# Altium schematic sheet SCH_WINGLET_DEBUG.SchDoc: Winglet Debug
size B; DrawnBy: HCAdam; Organization: Aerospace Village; DocumentNumber: WINGLET; Revision: A; SheetNumber: 10; SheetTotal: 10
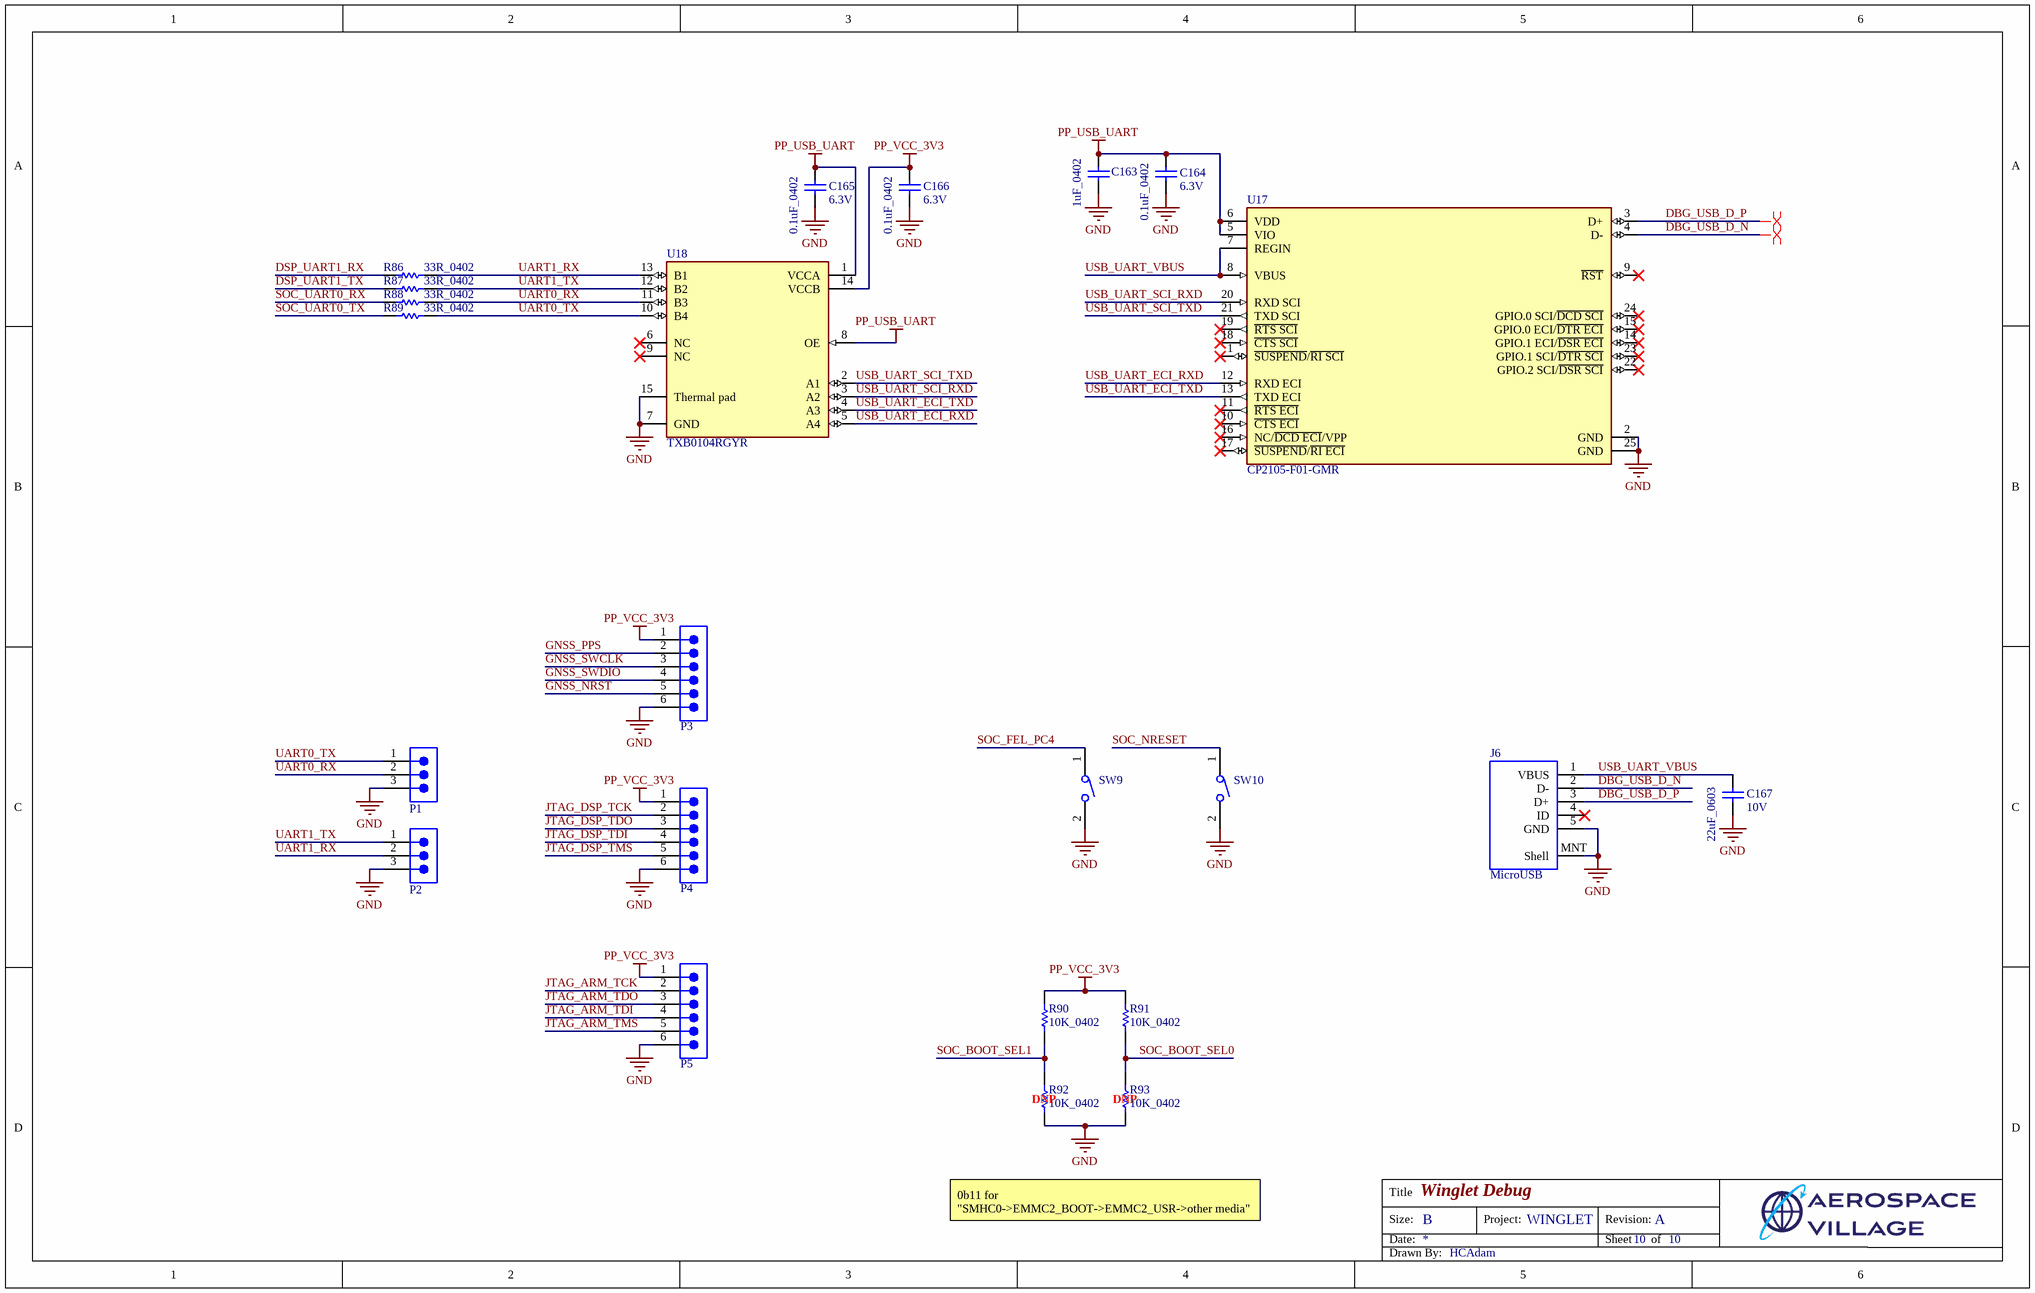
[diagram p0: SCH_WINGLET_DEBUG.SchDoc]

## Parts
C163  1uF_0402  [CAPC1005X55X25NL5T10]
C164  0.1uF_0402  Voltage Rating: 6.3V  [CAPC1005X56X25NL10T15]
C165  0.1uF_0402  Voltage Rating: 6.3V  [CAPC1005X56X25NL10T15]
C166  0.1uF_0402  Voltage Rating: 6.3V  [CAPC1005X56X25NL10T15]
C167  22uF_0603  Voltage Rating: 10V  [CAPC1608X100X20NL10]
J6  MicroUSB  [LCSC_MicroQTJ]
P1  TSW-103-07-G-S  [SMTC-TSW-103-07-X-S]  (value not drawn)
P2  TSW-103-07-G-S  [SMTC-TSW-103-07-X-S]  (value not drawn)
P3  TSW-106-07-F-S  [SMTC-TSW-106-07-X-S]  (value not drawn)
P4  TSW-106-07-F-S  [SMTC-TSW-106-07-X-S]  (value not drawn)
P5  TSW-106-07-F-S  [SMTC-TSW-106-07-X-S]  (value not drawn)
R86  33R_0402  [RESC1005X40X25NL05T05]
R87  33R_0402  [RESC1005X40X25NL05T05]
R88  33R_0402  [RESC1005X40X25NL05T05]
R89  33R_0402  [RESC1005X40X25NL05T05]
R90  10K_0402  [RESC1005X40X25NL05T05]
R91  10K_0402  [RESC1005X40X25NL05T05]
R92  10K_0402  [RESC1005X40X25NL05T05]
R93  10K_0402  [RESC1005X40X25NL05T05]
SW9  GT-TC029B-H025-L1N  [LCSC_SMD_SW_SMALL]  (value not drawn)
SW10  GT-TC029B-H025-L1N  [LCSC_SMD_SW_SMALL]  (value not drawn)
U17  CP2105-F01-GMR  [FP-CP2105-F01-GMR-MFG]
U18  TXB0104RGYR  [FP-RGY0014A-MFG]

## Nets
GND: C163.1 C164.1 C165.1 C166.1 C167.1 J6.5(GND) J6.MNT(Shell) P1.3 P2.3 P3.6 P4.6 P5.6 R92.2 R93.2 SW9.2 SW10.2 U17.2(GND) U17.25(GND) U18.7(GND) U18.15(Thermal_pad)
PP_USB_UART: C163.2 C164.2 C165.2 U17.5(VIO) U17.6(VDD) U18.1(VCCA) U18.8(OE)
PP_VCC_3V3: C166.2 P3.1 P4.1 P5.1 R90.1 R91.1 U18.14(VCCB)
DBG_USB_D_N: J6.2(D-) U17.4(D-)
DBG_USB_D_P: J6.3(D+) U17.3(D+)
DSP_UART1_RX: R86.1
DSP_UART1_TX: R87.1
GNSS_NRST: P3.5
GNSS_PPS: P3.2
GNSS_SWCLK: P3.3
GNSS_SWDIO: P3.4
JTAG_ARM_TCK: P5.2
JTAG_ARM_TDI: P5.4
JTAG_ARM_TDO: P5.3
JTAG_ARM_TMS: P5.5
JTAG_DSP_TCK: P4.2
JTAG_DSP_TDI: P4.4
JTAG_DSP_TDO: P4.3
JTAG_DSP_TMS: P4.5
SOC_BOOT_SEL0: R91.2 R93.1
SOC_BOOT_SEL1: R90.2 R92.1
SOC_FEL_PC4: SW9.1
SOC_NRESET: SW10.1
SOC_UART0_RX: R88.1
SOC_UART0_TX: R89.1
UART0_RX: P1.2 R88.2 U18.11(B3)
UART0_TX: P1.1 R89.2 U18.10(B4)
UART1_RX: P2.2 R86.2 U18.13(B1)
UART1_TX: P2.1 R87.2 U18.12(B2)
USB_UART_ECI_RXD: U17.12(RXD_ECI) U18.5(A4)
USB_UART_ECI_TXD: U17.13(TXD_ECI) U18.4(A3)
USB_UART_SCI_RXD: U17.20(RXD_SCI) U18.3(A2)
USB_UART_SCI_TXD: U17.21(TXD_SCI) U18.2(A1)
USB_UART_VBUS: C167.2 J6.1(VBUS) U17.7(REGIN) U17.8(VBUS)

Not connected (* = marked no-connect by the designer): J6 4(ID)*; U17 1(~{SUSPEND}/~{RI_SCI})* 9(~{RST})* 10(~{CTS_ECI})* 11(~{RTS_ECI})* 14(GPIO.1_ECI/~{DSR_ECI})* 15(GPIO.0_ECI/~{DTR_ECI})* 16(NC/~{DCD_ECI}/VPP)* 17(~{SUSPEND}/~{RI_ECI})* 18(~{CTS_SCI})* 19(~{RTS_SCI})* 22(GPIO.2_SCI/~{DSR_SCI})* 23(GPIO.1_SCI/~{DTR_SCI})* 24(GPIO.0_SCI/~{DCD_SCI})*; U18 6(NC)* 9(NC)*

## Layout directives
differential pair: DBG_USB_D_N, DBG_USB_D_P

## Notes on the sheet
- 0b11 for "SMHC0->EMMC2_BOOT->EMMC2_USR->other media"
- Title
- Size:
- Date:
- B
- Project:
- Revision:
- Sheet
- of
- Drawn By:

## Library data of the parts
C163 = CMP-1662-00020-1: Chip Capacitor, 1 uF, +/- 10%, 6.3 V, -55 to 85 degC, 0402 (1005 Metric), RoHS, Tape and Reel / GRM155R60J105KE19D; Voltage Rating (DC): 3 V; Type (Capacitors): X5R; Voltage Rating: 6.3 V; Capacitance: 1 uF; ComponentLink2Description: Datasheet; ComponentLink2URL: http://psearch.en.murata.com/capacitor/product/GRM155R60J105KE19%23.pdf; Max Operating Temperature: 85 degC; Min Operating Temperature: -55 degC; Package Quantity: 10000; Mounting Technology: Surface Mount; ComponentLink1Description: Manufacturer URL; ComponentLink1URL: http://www.murata.com/; PackageDescription: 2-Pin Surface Mount Device, Body 1 x 0.5 mm; Tolerance: 10%; Case/Package: 0402; Mount: Surface Mount; Packaging: Tape and Reel; Case Code (Metric): 1005; Radiation Hardening: No; Width: 0.5 mm; Length: 1 mm; DatasheetVersion: 08/2016; Height: 0.5 mm; PartNumber: GRM155R60J105KE19D; RoHSCompliant: true; Case Code (Imperial): 0402; REACH SVHC: No SVHC; Pins: 2
C164-C166 = CMP-2008-02743-1: 04026D104KAT2A; Manufacturer: AVX Interconnect / Elco; Part Number: 04026D104KAT2A
C167 = CMP-2000-05441-1: Chip Capacitor, 22 uF, +/- 20%, 10 V, -55 to 85 degC, 0603 (1608 Metric), RoHS, Tape and Reel / PN: C1608X5R1A226M080AC; Manufacturer: TDK; PCN Part Number: MLCCPartNumberChange30/Nov/2012; Product Training Modules: CSeriesGeneralApplicationsSEAT,CCV,andTVCLDesignToolsGuidetoReplacinganElectrolyticCapacitorwithanMLCC; Other Names: 445-9077-1; Design Resources: 20WNon-IsolatedBuckLEDDriverUsingPLLNK460KG; Online Catalog: CSeries,GeneralPurpose; Capacitance: 22µF; Temperature Coefficient: X5R; Kits: 445-9014-KIT-ND-KITMLCC100PF-22UF060310-50V; Packaging: CutTape(CT); Standard Package: 1; Package / Case: 0603(1608Metric); Lead Style: -; Features: -; Ratings: -; Voltage - Rated: 10V; Operating Temperature: -55degC~85degC; Applications: GeneralPurpose; Package Reference: 603; Datasheet URL: http://download.siliconexpert.com/pdfs/2015/4/21/15/54/45/779/tdk_/manual/37024850441143360mlcc_commercial_general_en.pdf; Datasheet Version: Mar-15; Mounting Type: SurfaceMount,MLCC; Lead Spacing: -; Size / Dimension: 0.063"Lx0.031"W(1.60mmx0.80mm); Height - Seated (Max): -; Package Description: 2-Pin Surface Mount Device, Body 1.6 x 0.8 mm; Manufacturer URL: http://www.tdk.com/; RoHS Information: RoHSCertificate-MLCC; Tolerance: ±20%; Series: C; Thickness (Max): 0.035"(0.90mm); Family: CeramicCapacitors; Category: Capacitors
J6 = MicroQTJ: MicroQTJ MicroUSB CONN
P1 P2 = CMP-1024-00333-1: 0.025" SQ Post Header, Through-hole, Vertical, -55 to 125 degC, 2.54 mm Pitch, 3-Pin, Male, RoHS; Manufacturer: Samtec; Pitch: 2.54 mm; ComponentLink3URL: http://www.samtec.com/documents/webfiles/cpdf/TSW-XXX-XX-XXX-X-XX-XXX-MKT.pdf; Temperature Range: -55 to 125 degC; DatasheetVersion: F-214; ComponentLink1Description: Manufacturer URL; ComponentLink2URL: http://www.samtec.com/documents/webfiles/pdf/TSW_TH.PDF; RoHS: True; Orientation: Vertical; ComponentLink2Description: Datasheet; ComponentLink3Description: Package Specification; PackageDescription: .025[0.64] SQ. Post Terminal Strip Assembly; Mounting Technology: Through-hole; PackageVersion: DM, 8/1988; ComponentLink1URL: http://www.samtec.com; PackageReference: TSW-103-07-X-S; PartNumber: TSW-103-07-G-S
P3-P5 = CMP-1024-00385-1: 0.025" SQ Post Header, Through-hole, Vertical, -55 to 125 degC, 2.54 mm Pitch, 6-Pin, Male, RoHS; Manufacturer: Samtec; Pitch: 2.54 mm; Orientation: Vertical; RoHS: True; ComponentLink3Description: Package Specification; PartNumber: TSW-106-07-F-S; Temperature Range: -55 to 125 degC; PackageVersion: DM, 8/1988; ComponentLink2URL: http://www.samtec.com/documents/webfiles/pdf/TSW_TH.PDF; ComponentLink1Description: Manufacturer URL; ComponentLink2Description: Datasheet; ComponentLink1URL: http://www.samtec.com; DatasheetVersion: F-214; PackageReference: TSW-106-07-X-S; PackageDescription: .025[0.64] SQ. Post Terminal Strip Assembly; ComponentLink3URL: http://www.samtec.com/documents/webfiles/cpdf/TSW-XXX-XX-XXX-X-XX-XXX-MKT.pdf; Mounting Technology: Through-hole
R86-R89 = CMP-2002-01146-1: ERJ2RKF33R0X; Manufacturer: Panasonic; Part Number: ERJ2RKF33R0X
R90-R93 = CMP-2000-07588-1: Chip Resistor, 10 KOhm, +/- 1%, 0.1 W, -55 to 155 degC, 0402 (1005 Metric), RoHS, Tape and Reel / ERJ2RKF1002X; Manufacturer: Panasonic; Power Rating: 100mW; Voltage Rating: 50V; Resistance: 10KOhm; Case\/Package: 0402; Temperature Coefficient: 100ppm\/degreesC; RoHSCompliant: True; Lead Free: LeadFree; Package Quantity: 1; Contact Plating: Tin; Length: 1mm; Radiation Hardening: No; REACH SVHC: NoSVHC; Max Operating Temperature: 155degC; Depth: 0.5mm; Case Code (Imperial): 0402; Military Standard: Not; Package Description: 2-Pin Surface Mount Device, Body 1 x 0.5 mm; Termination: SMD/SMT; Case Code (Metric): 1005; Height: 0.35mm; Packaging: TapeandReel; Voltage Rating (DC): 50V; Package Reference: 402; Number of Pins: 2; Tolerance: 1%; Mounting Technology: SurfaceMount; Width: 0.02inch; Mount: SurfaceMount; Datasheet URL: https://industrial.panasonic.com/cdbs/www-data/pdf/RDA0000/AOA0000C304.pdf; Composition: ThickFilm; Datasheet Version: 02/2017; Manufacturer URL: http://www.panasonic.com/; Max Power Dissipation: 100mW; Number of Terminations: 2; Min Operating Temperature: -55degC
  R92 R93: DNP: DNP
SW9 SW10 = GT-TC029B-H025-L1N: SMD SPST Tactile Switch / C843669
U17 = CMP-08107-000002-1: IC SGL USB-DL UART BRIDGE 24QFN; Manufacturer: Silicon Labs; Standoff Height: 0mm; Max Supply Voltage: 5.25V; Min Supply Voltage: 1.8V; Function: Bridge, USB to UART; Interface: UART,USB; Nominal Supply Current: 17mA; Height: 0.8mm; Ambient Temperature Range High: +125°C; Ipc Land Pattern Name: QFN50P400X400X75-24; Mouser Description: I/O Controller Interface IC USB to Dual UART bridge; Octopart: https://octopart.com/cp2105-f01-gmr-silicon+labs-19668643; Automotive: No; RoHS: TRUE; Manufacturer Part Number: CP2105-F01-GMR; Temperature: -40°C to +85°C; Temperature Range Low: -40°C; Temperature Range High: +85°C; Category: IC; ComponentLink2Description: Datasheet; Digikey Description: IC SGL USB-DL UART BRIDGE 24QFN; Device Class L1: Integrated Circuits (ICs); Device Class L2: Interface ICs; Ambient Temperature Range Low: -55°C; Package: CP2105-F01-GMR; Device Class L3: Controllers; Lead Free: Yes; ComponentLink2URL: https://www.silabs.com/documents/public/data-sheets/CP2105.pdf
U18 = CMP-04899-000011-1: IC TRNSLTR BIDIRECTIONAL 14VQFN; Manufacturer: Texas Instruments; Standoff Height: 0mm; V B Min: 1.65V; Data Rate: 100Mbits/s; Number Of Circuits: 1; V B Max: 5.5V; Number Of Inputs: 4; Logic Function Desc: Non-Inverting; Max Junction Temp: +150°C; V A Min: 1.2V; Nominal Supply Current: 0.06-3.5uA; V A Max: 3.6V; Propagation Delay: 4ns; Device Class L1: Integrated Circuits (ICs); ComponentLink2Description: Datasheet; Mouser Description: 4-Bit Bidirectional Voltage-Level Shifter with Auto Direction Sensing and +/-15 kV ESD Protect 14-VQFN -40 to 85; Ambient Temperature Range Low: -40°C; Temperature: -40°C to +85°C; RoHS: TRUE; Digikey Description: IC TRNSLTR BIDIRECTIONAL 14VQFN; Manufacturer Part Number: TXB0104RGYR; Lead Free: Yes; Octopart: https://octopart.com/txb0104rgyr-texas+instruments-1485948; Height: 1mm; Device Class L3: Voltage Level Shifters; Category: IC; Device Class L2: Logic ICs; Temperature Range Low: -40°C; Number Of Outputs: 4; Temperature Range High: +85°C; Package: RGY0014A; Automotive: No; Ambient Temperature Range High: +85°C; Min Supply Voltage: 1.2V; ComponentLink2URL: http://www.ti.com/lit/ds/symlink/txb0104.pdf; Max Supply Voltage: 5.5V